# Altium schematic sheet pll_schematic.SchDoc
size A4
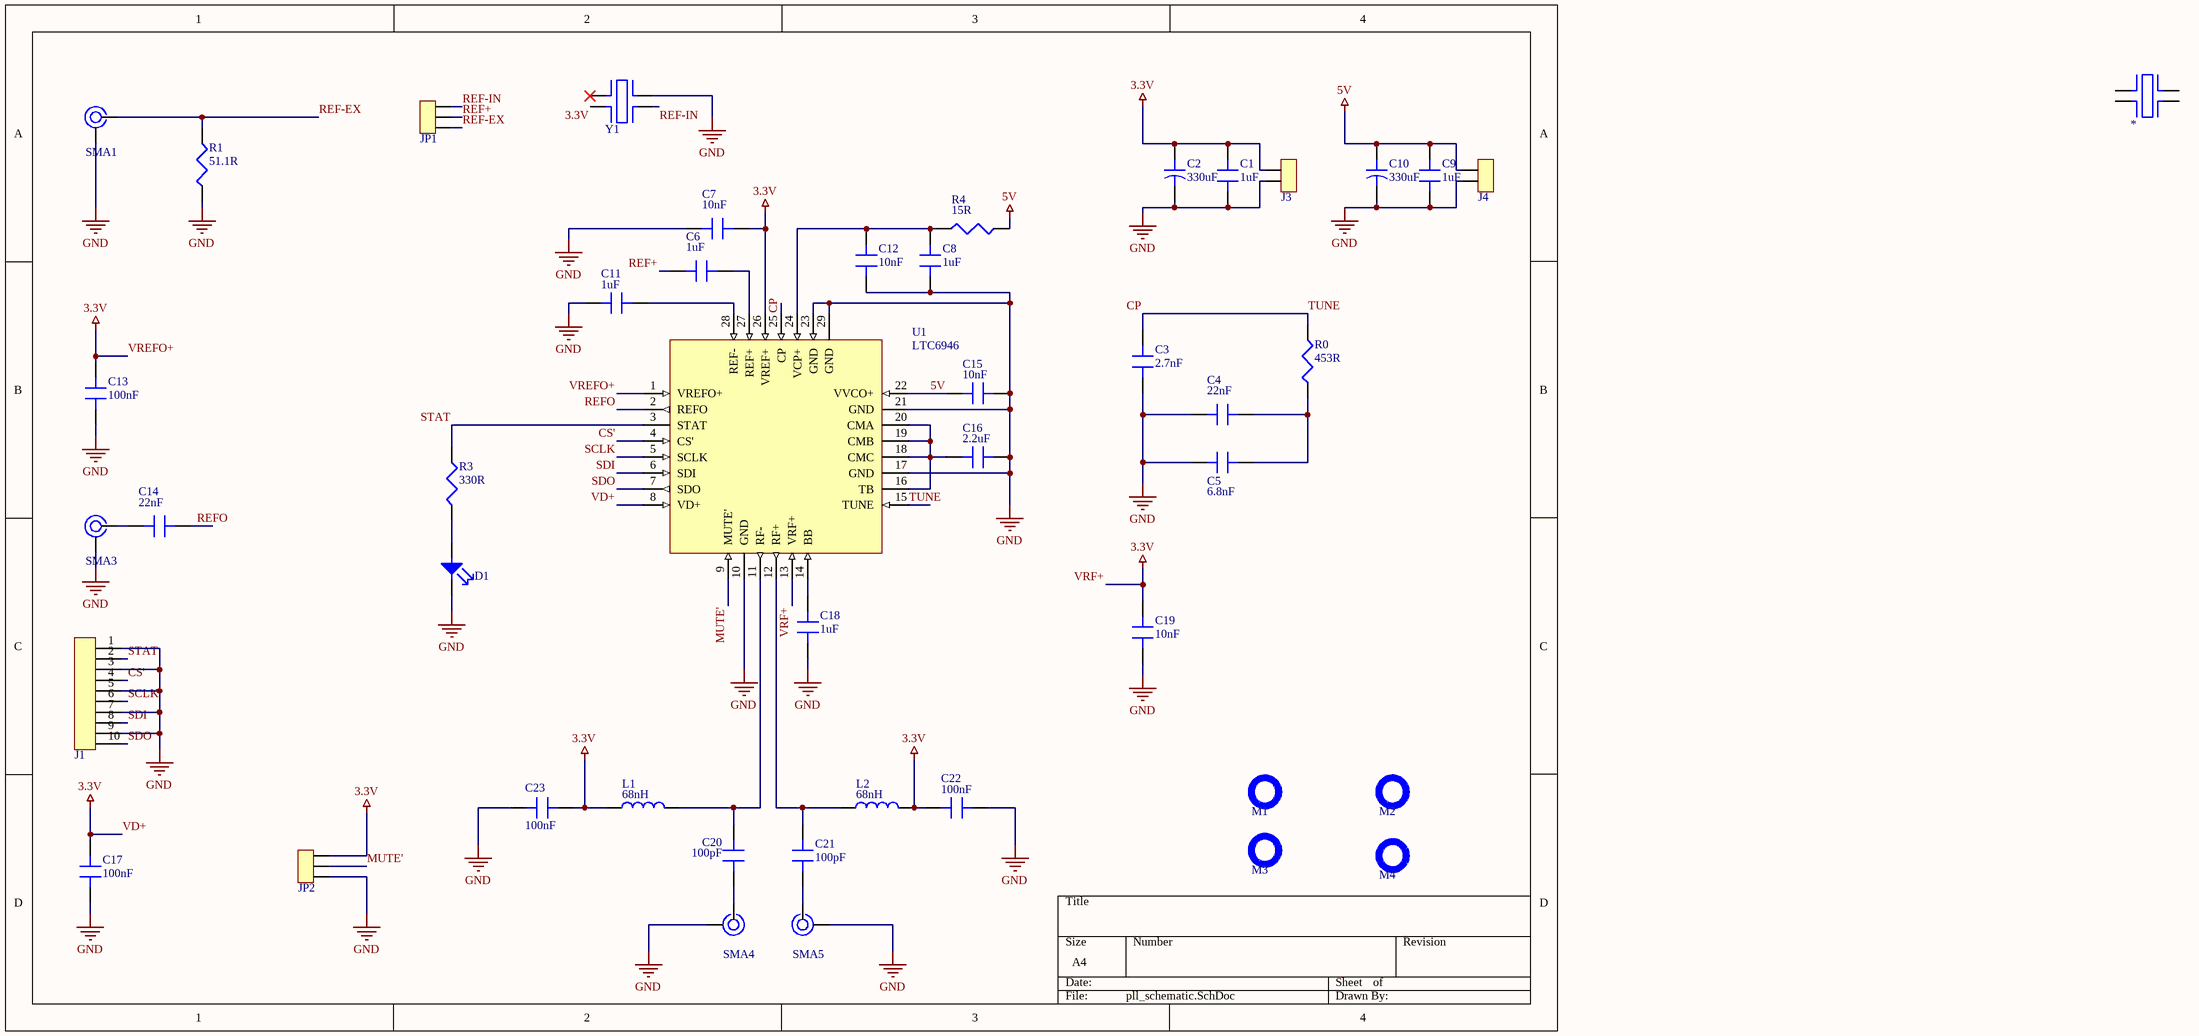
[diagram p0: pll_schematic.SchDoc]

## Parts
*  -  (value not drawn)
C1  1uF  [C0603]
C2  330uF  [C_TANT_D]
C3  2.7nF  [C0603]
C4  22nF  [C0603]
C5  6.8nF  [C0603]
C6  1uF  [C0603]
C7  10nF  [C0603]
C8  1uF  [C0603]
C9  1uF  [C0603]
C10  330uF  [C_TANT_D]
C11  1uF  [C0603]
C12  10nF  [C0603]
C13  100nF  [C0603]
C14  22nF  [C0603]
C15  10nF  [C0603]
C16  2.2uF  [C0805]
C17  100nF  [C0603]
C18  1uF  [C0603]
C19  10nF  [C0603]
C20  100pF  [C0603]
C21  100pF  [C0603]
C22  100nF  [C0603]
C23  100nF  [C0603]
D1  -  [D0805]  (value not drawn)
J1  -  [IDC-2x05]  (value not drawn)
J3  -  [DG130-5.0]  (value not drawn)
J4  -  [DG130-5.0]  (value not drawn)
JP1  -  [PIN_HEADER_1x03]  (value not drawn)
JP2  -  [PIN_HEADER_1x03]  (value not drawn)
L1  68nH  [L0402]
L2  68nH  [L0402]
M1  MOUNTING_HOLE  [MOUNTING_HOLE_NP_M3]  (value not drawn)
M2  MOUNTING_HOLE  [MOUNTING_HOLE_NP_M3]  (value not drawn)
M3  MOUNTING_HOLE  [MOUNTING_HOLE_NP_M3]  (value not drawn)
M4  MOUNTING_HOLE  [MOUNTING_HOLE_NP_M3]  (value not drawn)
R0  453R  [R0603]
R1  51.1R  [R0603]
R3  330R  [R0603]
R4  15R  [R0603]
SMA1  -  [SMA]  (value not drawn)
SMA3  -  [SMA]  (value not drawn)
SMA4  -  [SMA]  (value not drawn)
SMA5  -  [SMA]  (value not drawn)
U1  LTC6946  [QFN50P400X500X80_HS-29N_2]
Y1  -  [XOSC]  (value not drawn)

## Nets
3.3V: C1.2(-) C2.1(-) C7.1(-) C13.2(-) C17.2(-) C19.2(-) C22.1(-) C23.1(-) J3.1(-) JP2.1(-) L1.1(-) L2.2(-) U1.1(VREFO+) U1.8(VD+) U1.13(VRF+) U1.26(VREF+) Y1.8  [also labelled VD+, VREFO+, VRF+]
5V: C9.1(-) C10.1(-) C15.1(-) J4.1(-) R4.2(-) U1.22(VVCO+)
GND: C1.1(-) C2.2(-) C3.1(-) C4.2(-) C5.2(-) C7.2(-) C8.1(-) C9.2(-) C10.2(-) C11.1(-) C12.2(-) C13.1(-) C15.2(-) C16.2(-) C17.1(-) C18.1(-) C19.1(-) C22.2(-) C23.2(-) D1.C J1.1 J1.3 J1.5 J1.7 J1.9 J3.2(-) J4.2(-) JP2.3(-) R1.1(-) SMA1.2(-) SMA3.2(-) SMA4.2(-) SMA5.2(-) U1.10(GND) U1.17(GND) U1.21(GND) U1.23(GND) U1.29(GND) Y1.4
CP: C3.2(-) R0.2(-) U1.15(TUNE) U1.25(CP)  [also labelled TUNE]
CS': J1.4 U1.4(CS')
MUTE': JP2.2(-) U1.9(MUTE')
REF+: C6.1(-) JP1.2(-)
REF-EX: JP1.3(-) R1.2(-) SMA1.1(-)
REF-IN: JP1.1(-) Y1.5
REFO: C14.2(-) U1.2(REFO)
SCLK: J1.6 U1.5(SCLK)
SDI: J1.8 U1.6(SDI)
SDO: J1.10 U1.7(SDO)
STAT: J1.2 R3.2(-) U1.3(STAT)
NetC4_1: C4.1(-) C5.1(-) R0.1(-)
NetC6_2: C6.2(-) U1.27(REF+)
NetC8_2: C8.2(-) C12.1(-) R4.1(-) U1.24(VCP+)
NetC11_2: C11.2(-) U1.28(REF-)
NetC14_1: C14.1(-) SMA3.1(-)
NetC16_1: C16.1(-) U1.16(TB) U1.18(CMC) U1.19(CMB) U1.20(CMA)
NetC18_2: C18.2(-) U1.14(BB)
NetC20_1: C20.1(-) SMA4.1(-)
NetC20_2: C20.2(-) L1.2(-) U1.11(RF-)
NetC21_1: C21.1(-) SMA5.1(-)
NetC21_2: C21.2(-) L2.1(-) U1.12(RF+)
NetD1_A: D1.A R3.1(-)

Not connected (* = marked no-connect by the designer): * 1 4 5 8; Y1 1*

## Library data of the parts
* Y1 = OSC
C1 C3-C9 C11-C23 = C
C2 C10 = CP
D1 = LED
J1 = Conn_Gene_1x10
J3 J4 = Conn_Gene_1x02
JP1 JP2 = Pin Header 1x03
L1 L2 = L
M1-M4 = MOUNTING_HOLE: Non-Plated
R0 R1 R3 R4 = R
SMA1 SMA3-SMA5 = SMA
U1 = LTC6946IUFD-1#PBF-ND: ComponentLink1Description: LTC6946; ComponentLink1URL: https://www.digikey.com/en/products/detail/analog-devices-inc/LTC6946IUFD-1-PBF/2756832